# Altium schematic sheet JSB_Schematic.SchDoc
size A4; SheetNumber: 1; SheetTotal: 1
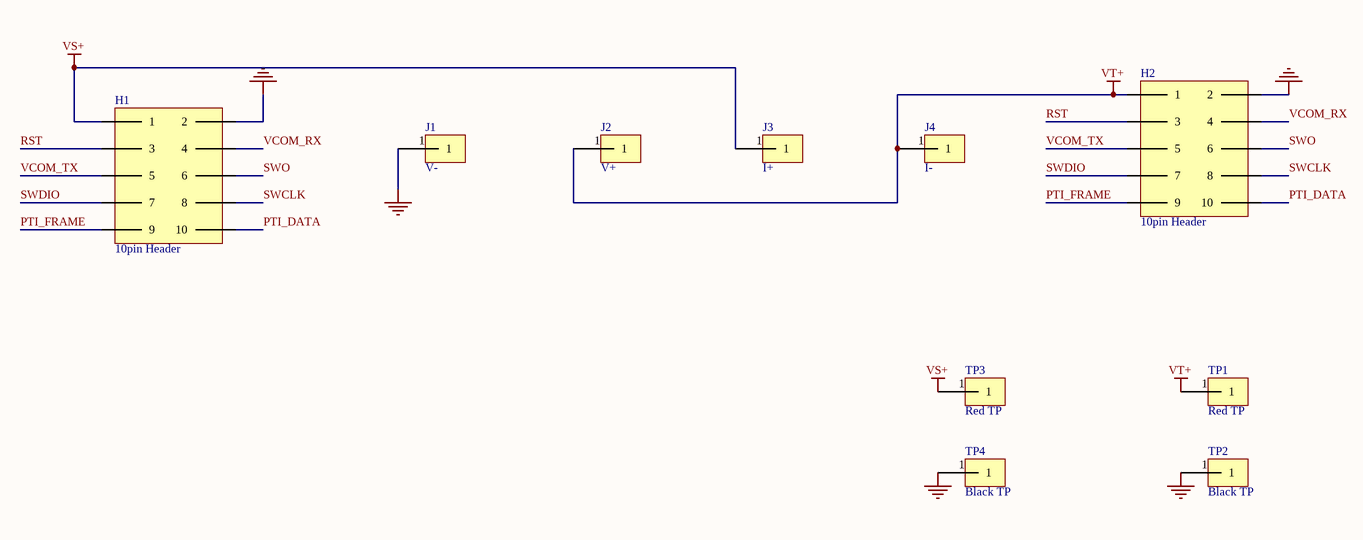
[diagram p0: JSB_Schematic.SchDoc]

## Parts
H1  10pin Header  [20021121]
H2  10pin Header  [20021121]
J1  V-  [654]
J2  V+  [654]
J3  I+  [654]
J4  I-  [654]
TP1  Red TP  [5190TR]
TP2  Black TP  [5191TR]
TP3  Red TP  [5190TR]
TP4  Black TP  [5191TR]

## Nets
GND: H1.2 H2.2 J1.1 TP2.1 TP4.1
VS+: H1.1 J3.1 TP3.1
VT+: H2.1 J2.1 J4.1 TP1.1
PTI_DATA: H1.10 H2.10
PTI_FRAME: H1.9 H2.9
RST: H1.3 H2.3
SWCLK: H1.8 H2.8
SWDIO: H1.7 H2.7
SWO: H1.6 H2.6
VCOM_RX: H1.4 H2.4
VCOM_TX: H1.5 H2.5

## Library data of the parts
H1 H2 = 20021121-00010C4LF: 10 Pin Mini Header; Manufacturer: Amphenol ICC / FCI; Supplier: Digi-Key; Supplier Part Number: 609-3695-1-ND; Manufacturer Part Number: 20021121-00010C4LF; RoHS: No; Category: Headers and Wire Housings; Stock: 137144; Pricing: 1=0,99, 10=0,839, 100=0,7533 (USD); ComponentLink1URL: https://datasheet.ciiva.com/11749/0900766b8118d62a-11749057.pdf?src-supplier=Rs; ComponentLink1Description: https://datasheet.ciiva.com/11749/0900766b8118d62a-11749057.pdf?src-supplier=Rs
J1-J4 = 654: CONN BANANA PLUG THRD; Manufacturer: Keystone Electronics; Connector Type: Interconnection Device; Supplier: Digi-Key; Supplier Part Number: 36-654-ND; Manufacturer Part Number: 654; RoHS: Yes; Category: Connectors; Stock: 4200; Pricing: 1=2,73, 25=2,3996, 100=2,1816, 250=1,98876, 500=1,85436, 1000=1,58166, 2500=1,47258 (USD); RoHS Compliant: Yes; Reach SVHC Compliant: Yes; ComponentLink1URL: https://datasheet.ciiva.com:443/pdfs/VipMasterIC/IC/KEYC/KEYCS00181/KEYCS00191-1.pdf?src-supplier=IHS+Markit; ComponentLink1Description: https://datasheet.ciiva.com:443/pdfs/VipMasterIC/IC/KEYC/KEYCS00181/KEYCS00191-1.pdf?src-supplier=IHS+Markit; ComponentLink2URL: http://mail.keyelco.com/ENG._DEPT/PDF%20CAT%20NO%20Drawings/654.pdf?src-supplier=Digi-Key; ComponentLink2Description: http://mail.keyelco.com/ENG._DEPT/PDF%20CAT%20NO%20Drawings/654.pdf?src-supplier=Digi-Key; ComponentLink3URL: http://keyelco.com/userAssets/file/M65p110.pdf?src-supplier=Digi-Key; ComponentLink3Description: http://keyelco.com/userAssets/file/M65p110.pdf?src-supplier=Digi-Key
TP1 TP3 = 5190TR: RED SMD Test Point; Manufacturer: Keystone Electronics; Supplier: Digi-Key; Supplier Part Number: 36-5190CT-ND; Manufacturer Part Number: 5190TR; RoHS: Yes; Category: Connectors; Stock: 241676; Pricing: 1=0,42, 10=0,401, 25=0,3436, 50=0,292, 100=0,2806, 250=0,25196, 500=0,24052 (USD); ComponentLink1URL: https://www.keyelco.com/product-pdf.cfm?p=14478&src-supplier=Digi-Key; ComponentLink1Description: https://www.keyelco.com/product-pdf.cfm?p=14478&src-supplier=Digi-Key
TP2 TP4 = 5191TR: BLACK SMD Test Point; Manufacturer: Keystone Electronics; Supplier: Digi-Key; Supplier Part Number: 36-5191CT-ND; Manufacturer Part Number: 5191TR; RoHS: Yes; Category: Connectors; Stock: 118911; Pricing: 1=0,42, 10=0,401, 25=0,3436, 50=0,292, 100=0,2806, 250=0,25196, 500=0,24052 (USD); RoHS Compliant: Yes